# EAGLE design p2 020 (EAGLE 8.7.0)
COMPANY: ADAFRUIT INDUSTRIES; DRAWN: KTOWN; REV: B
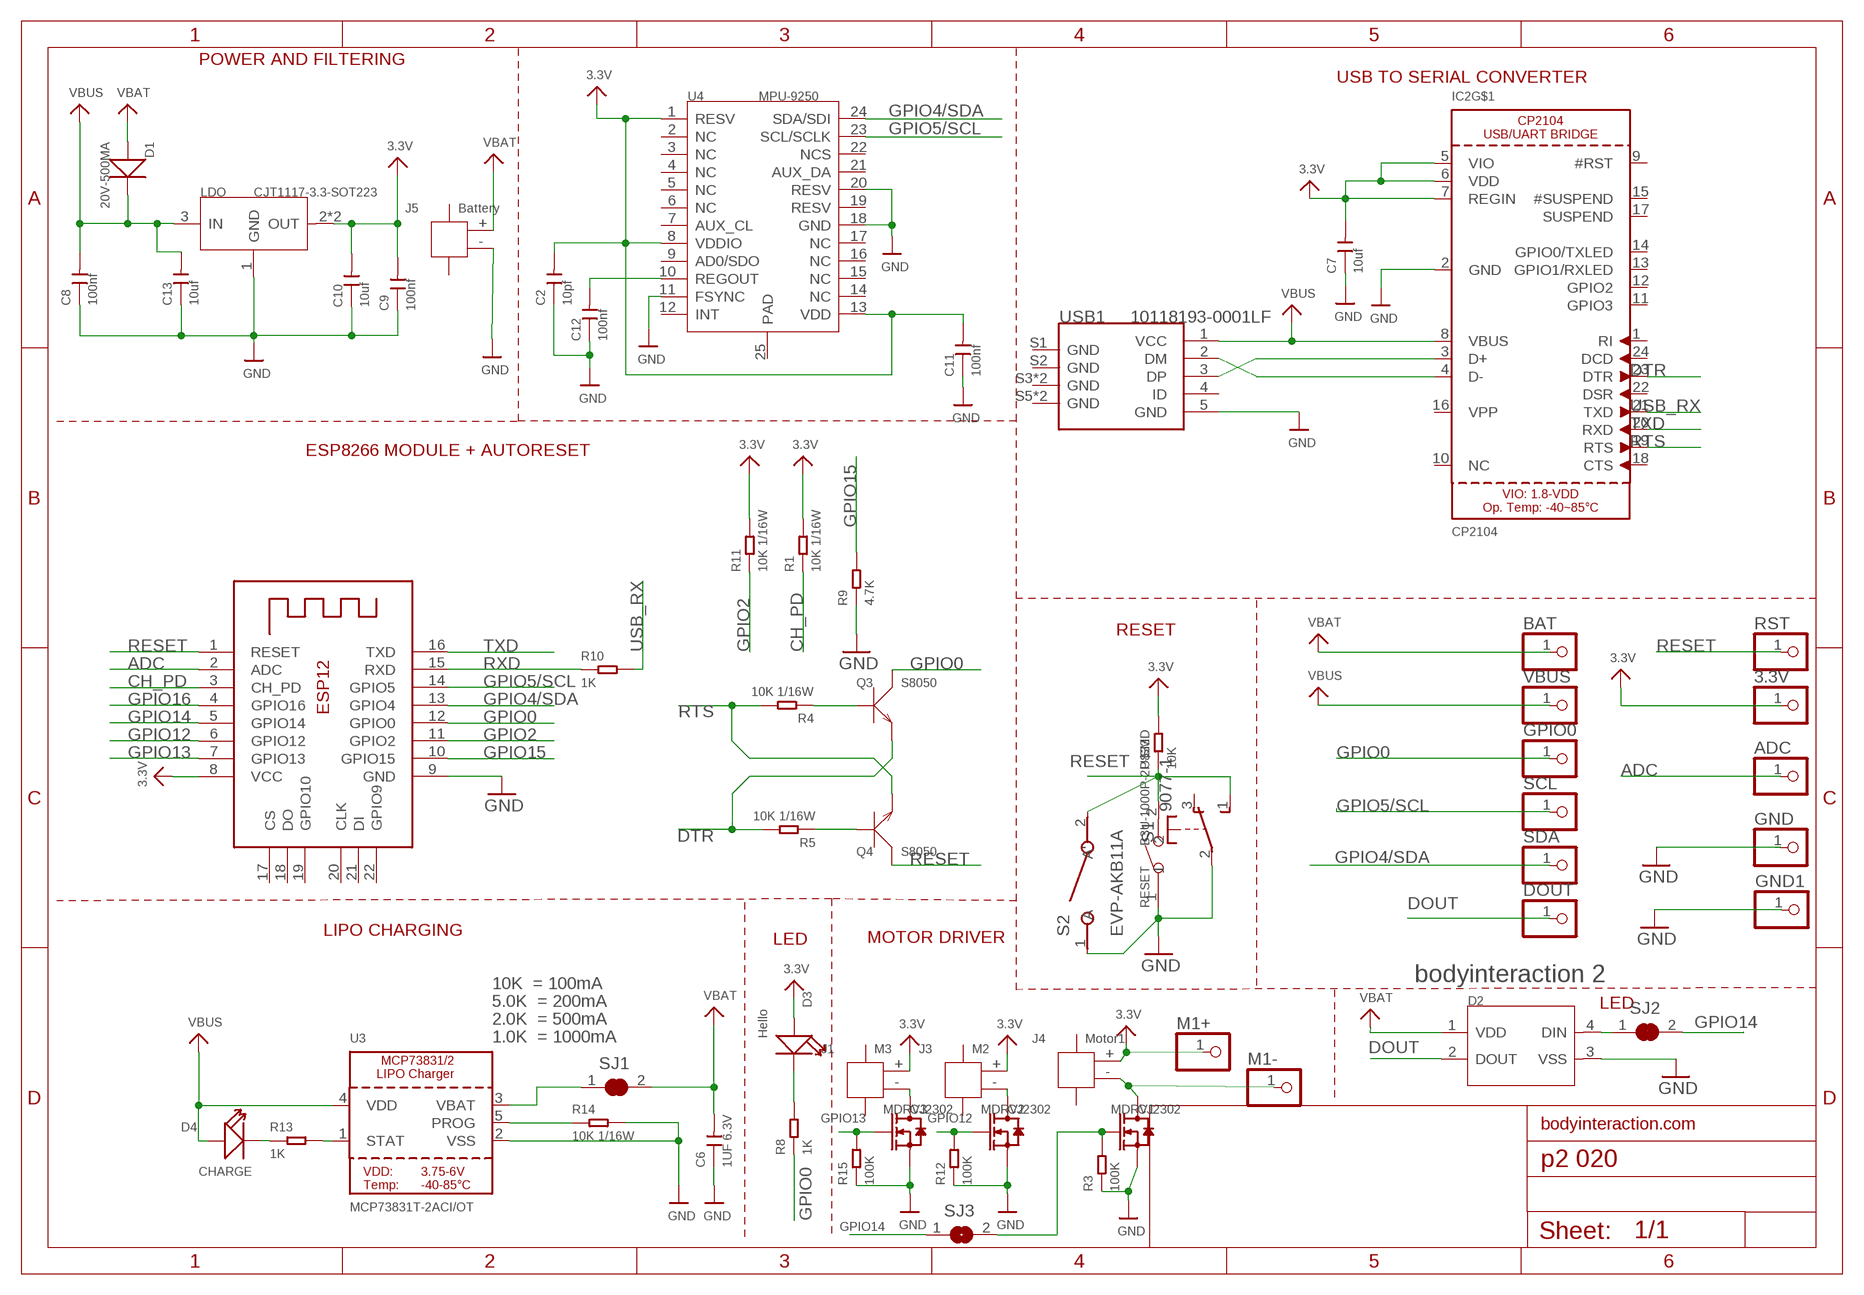
[diagram p0: schematic, sheet 1]

## Parts
3.3V  PINHD-1X1  [1X01]
ADC  PINHD-1X1  [1X01]
BAT  PINHD-1X1  [1X01]
C2  10pf  CERAMIC-10PF-50V-5%-NPO(0402)  [C0402]
C6  1UF 6.3V  CERAMIC-1UF-6.3V-10%-X5R(0402)  [C0402]
C7  10uf  CERAMIC-10UF-6.3V-20%-X5R(0402)  [C0402]
C8  100nf  CERAMIC-100NF-25V-10%-X7R(0402)  [C0402]
C9  100nf  CERAMIC-100NF-25V-10%-X7R(0402)  [C0402]
C10  10uf  CERAMIC-10UF-6.3V-20%-X5R(0402)  [C0402]
C11  100nf  CERAMIC-100NF-25V-10%-X7R(0402)  [C0402]
C12  100nf  CERAMIC-100NF-25V-10%-X7R(0402)  [C0402]
C13  10uf  CERAMIC-10UF-6.3V-20%-X5R(0402)  [C0402]
D1  20V-500MA  SMD-DIODE-SCHOTTKY-20V-500MA(SOD-123)P  [SOD-123]
D2  SMD-RGB-LED-4P'WS2812B'  [LED4-SMD-5050]
D3  Hello  SMD-LED-CLEAR-YELLOW(0603)  [LED-0603]
D4  CHARGE  SMD-LED-YELLOW-DIFFUSED-PURE-WHITE(0402)  [LED-0402]
DOUT  PINHD-1X1  [1X01]
ESP  ESP-12  ESP-12E  [ESP-12E]
GND  PINHD-1X1  [1X01]
GND1  PINHD-1X1  [1X01]
GPIO0  PINHD-1X1  [1X01]
IC2  CP2104  [QFN24_4MM_SMSC]
J1  M3  SMD-JST-2P-1.0-90D  [HW2-SMD-1.0-90D]
J3  M2  SMD-JST-2P-1.0-90D  [HW2-SMD-1.0-90D]
J4  Motor1  SMD-JST-2P-1.0-90D  [HW2-SMD-1.0-90D]
J5  Battery  SMD-JST-2P-1.0-90D  [HW2-SMD-1.0-90D]
LDO  CJT1117-3.3-SOT223  PMIC-CJT1117-3.3(SOT223)  [SOT-223]
M1+  PINHD-1X1  [1X01]
M1-  PINHD-1X1  [1X01]
MDRV1  CJ2302  SMD-MOSFET-N-CH-20V-2.1A-CJ2302(SOT-23)  [SOT-23]
MDRV2  CJ2302  SMD-MOSFET-N-CH-20V-2.1A-CJ2302(SOT-23)  [SOT-23]
MDRV3  CJ2302  SMD-MOSFET-N-CH-20V-2.1A-CJ2302(SOT-23)  [SOT-23]
Q3  S8050  SMD-TRANSISTORS-NPN-25V-500MW-S8050(SOT-23)  [SOT-23]
Q4  S8050  SMD-TRANSISTORS-NPN-25V-500MW-S8050(SOT-23)  [SOT-23]
R1  10K 1/16W  SMD-RES-10K-1%-1/16W(0402)  [R0402]
R3  100K  SMD-RES-100K-1%-1/16W(0402)  [R0402]
R4  10K 1/16W  SMD-RES-10K-1%-1/16W(0402)  [R0402]
R5  10K 1/16W  SMD-RES-10K-1%-1/16W(0402)  [R0402]
R8  1K  SMD-RES-1K-5%-1/16W(0402)  [R0402]
R9  4.7K  SMD-RES-4.7K-5%-1/16W(0402)  [R0402]
R10  1K  SMD-RES-1K-5%-1/16W(0402)  [R0402]
R11  10K 1/16W  SMD-RES-10K-1%-1/16W(0402)  [R0402]
R12  100K  SMD-RES-100K-1%-1/16W(0402)  [R0402]
R13  1K  SMD-RES-1K-5%-1/16W(0402)  [R0402]
R14  10K 1/16W  SMD-RES-10K-1%-1/16W(0402)  [R0402]
R15  100K  SMD-RES-100K-1%-1/16W(0402)  [R0402]
RESET  B3U-1000P-2P-SMD  SMD-BUTTON(2P-3.0X2.5X1.2+0.4MM)-B3U-1000P-2P-SMD  [SW2-2.6-3.0X2.5X1.2+0.4MM]
RST  PINHD-1X1  [1X01]
S1  9077-1  [9077-1]
S2  EVP-AKB11A  [SW_EVP-AKB11A]
SCL  PINHD-1X1  [1X01]
SDA  PINHD-1X1  [1X01]
SJ1  SOLDERJUMPER_CLOSED  [SOLDERJUMPER_CLOSEDWIRE]
SJ2  SOLDERJUMPER_CLOSED  [SOLDERJUMPER_CLOSEDWIRE]
SJ3  SJ  [SJ]
U3  MCP73831T-2ACI/OT  MCP73831/2  [SOT23-5]
U4  MPU-9250  MOTION/POSITION-MPU-9250(QFN24)  [QFN24G-0.4-3X3MM]
U$33  10K  SMD-RES-10K-5%-1/(0402)  [R0402]
USB1  10118193-0001LF  MICRO-USB-SMD-B-(10118193-0001LF)  [MICRO-USB5+6P-SMD-0.65-B]
VBUS  PINHD-1X1  [1X01]

## Nets
3.3V: 3.3V.1 C2.2 C7.2 C9.2 C10.2 C11.2 D3.+ ESP.8(VCC) IC2.5(VIO) IC2.6(VDD) IC2.7(REGIN) J1.+ J3.+ J4.+ LDO.2(OUT) LDO.TER(OUT) M1+.1 R1.2 R11.2 U4.1(RESV) U4.8(VDDIO) U4.13(VDD) U$33.2
ADC: ADC.1 ESP.2(ADC)
CH_PD: ESP.3(CH_PD) R1.1
DOUT: D2.2(DOUT) DOUT.1
DTR: IC2.23(DTR) Q3.2(E) R5.2
GND [GROUND]: C2.1 C6.1 C7.1 C8.1 C9.1 C10.1 C11.1 C12.1 C13.1 D2.3(VSS) ESP.9(GND) GND1.1 GND.1 IC2.2(GND) J5.- LDO.1(GND) MDRV1.2(S) MDRV2.2(S) MDRV3.2(S) R3.1 R9.1 R12.1 R14.2 R15.1 RESET.1 S1.2(P) S2.1(A) U3.2(VSS) U4.11(FSYNC) U4.18(GND) U4.20(RESV) USB1.5(GND)
GPIO0: ESP.12(GPIO0) GPIO0.1 Q3.3(C) R8.1
GPIO2: ESP.11(GPIO2) R11.1
GPIO4/SDA [SDA]: ESP.13(GPIO4) SDA.1 U4.24(SDA/SDI)
GPIO5/SCL [SCL]: ESP.14(GPIO5) SCL.1 U4.23(SCL/SCLK)
GPIO12: ESP.6(GPIO12) MDRV2.1(G) R12.2
GPIO13: ESP.7(GPIO13) MDRV3.1(G) R15.2
GPIO14: ESP.5(GPIO14) SJ2.2 SJ3.1
GPIO15: ESP.10(GPIO15) R9.2
GPIO16: ESP.4(GPIO16)
N$1: J3.- MDRV2.3(D)
N$2: D4.- R13.1
N$3: J4.- M1-.1 MDRV1.3(D)
N$4: IC2.3(D+) USB1.3(DP)
N$5: D3.- R8.2
N$6: D2.4(DIN) SJ2.1
N$7: IC2.4(D-) USB1.2(DM)
N$8: MDRV1.1(G) R3.2 SJ3.2
N$9: C12.2 U4.10(REGOUT)
N$12: Q4.1(B) R5.1
N$13: Q3.1(B) R4.1
N$14: R13.2 U3.1(STAT)
N$15: R14.1 U3.5(PROG)
N$16: SJ1.1 U3.3(VBAT)
N$19: J1.- MDRV3.3(D)
RESET: ESP.1(RESET) Q4.3(C) RESET.2 RST.1 S1.1(S) S2.2(A') U$33.1
RTS: IC2.19(RTS) Q4.2(E) R4.2
RXD: ESP.15(RXD) R10.1
TXD: ESP.16(TXD) IC2.20(RXD)
USB_RX: IC2.21(TXD) R10.2
VBAT [POWER]: BAT.1 C6.2 D1.+ D2.1(VDD) J5.+ SJ1.2
VBUS [POWER]: C8.2 C13.2 D1.- D4.+ IC2.8(VBUS) LDO.3(IN) U3.4(VDD) USB1.1(VCC) VBUS.1
Unconnected: ESP.17(CS) ESP.18(DO) ESP.19(GPIO10) ESP.20(CLK) ESP.21(DI) ESP.22(GPIO9) IC2.1(RI) IC2.9(#RST) IC2.10(NC) IC2.11(GPIO3) IC2.12(GPIO2) IC2.13(GPIO1/RXLED) IC2.14(GPIO0/TXLED) IC2.15(#SUSPEND) IC2.16(VPP) IC2.17(SUSPEND) IC2.18(CTS) IC2.22(DSR) IC2.24(DCD) J1.3 J1.4 J3.3 J3.4 J4.3 J4.4 J5.3 J5.4 S1.3(O) U4.2(NC) U4.3(NC) U4.4(NC) U4.5(NC) U4.6(NC) U4.7(AUX_CL) U4.9(AD0/SDO) U4.12(INT) U4.14(NC) U4.15(NC) U4.16(NC) U4.17(NC) U4.19(RESV) U4.21(AUX_DA) U4.22(NCS) U4.25(PAD) USB1.4(ID) USB1.S1(GND) USB1.S2(GND) USB1.S3(GND) USB1.S4(GND) USB1.S5(GND) USB1.S6(GND)

## Notes on the sheet
- POWER AND FILTERING
- USB TO SERIAL CONVERTER
- ESP8266 MODULE + AUTORESET
- RESET
- LIPO CHARGING
- LED | MOTOR DRIVER
- bodyinteraction 2
- 10K  = 100mA
- 5.0K  = 200mA | LED
- 2.0K  = 500mA
- 1.0K  = 1000mA
- bodyinteraction.com

## Power pins joined to a net without a drawn wire
TP: IC2.THERM(TP)

## Library data of the parts
3.3V ADC BAT DOUT GND GND1 GPIO0 M1+ M1- RST SCL SDA VBUS = pinhead:PINHD-1X1: PIN HEADER
C2 = Seeed-Capacitor-2016:CERAMIC-10PF-50V-5%-NPO(0402): 302010001; MPN: CC0402JRNPO9BN100
C6 = Seeed-OPL-Capacitor:CERAMIC-1UF-6.3V-10%-X5R(0402): 302010003; MPN: CC0402KRX5R5BB105
C7 C10 C13 = Seeed-OPL-Capacitor:CERAMIC-10UF-6.3V-20%-X5R(0402): 302010053; MPN: CC0402MRX5R5BB106
C8 C9 = Seeed-OPL-Capacitor:CERAMIC-100NF-25V-10%-X7R(0402): 302010024; MPN: CC0402KRX7R8BB104
C11 C12 = Seeed-Capacitor-2016:CERAMIC-100NF-25V-10%-X7R(0402): 302010024; MPN: CC0402KRX7R8BB104
D1 = Seeed-Diode-2016:SMD-DIODE-SCHOTTKY-20V-500MA(SOD-123)P: 304020028; MPN: MBR0520LT1G
D2 = Seeed-OPL-2017-01-Diode-james:SMD-RGB-LED-4P: 304990003
D3 = Seeed-OPL-Diode:SMD-LED-CLEAR-YELLOW(0603): 304090044; MPN: 19-217-Y5C-AM1N1VY-3T; VALUE: YELLOW-0603
D4 = Seeed-OPL-Diode:SMD-LED-YELLOW-DIFFUSED-PURE-WHITE(0402): 304090016; MPN: 16-219A/T2D-AR2T1QY/3T; VALUE: PURE-WHITE-0402
ESP = microbuilder:ESP-12E
IC2 = microbuilder:CP2104: CP2104 - USB to UART Bridge VDD Output: 3.45V
J1 J3-J5 = Seeed-Connector -2016:SMD-JST-2P-1.0-90D: 320110054; VALUE: 2p-smd-1.0-90d
LDO = Seeed-IC-2016:PMIC-CJT1117-3.3(SOT223): 310030097; MPN: CJT1117-3.3
MDRV1-MDRV3 = Seeed-Transistor-2016:SMD-MOSFET-N-CH-20V-2.1A-CJ2302(SOT-23): 305030015; MPN: CJ2302
Q3 Q4 = Seeed-Transistor-2016:SMD-TRANSISTORS-NPN-25V-500MW-S8050(SOT-23): 305010017; MPN: S8050
R1 R4 R5 R11 = Seeed-Resistor-2016:SMD-RES-10K-1%-1/16W(0402): 301010047; MPN: RC0402FR-0710KL
R3 R12 R15 = Seeed-OPL-Resistor:SMD-RES-100K-1%-1/16W(0402): 301010456; MPN: RC0402FR-07100KL
R8 R10 = Seeed-Resistor-2016:SMD-RES-1K-5%-1/16W(0402): 301010006; MPN: RC0402JR-071KL
R9 = Seeed-Resistor-2016:SMD-RES-4.7K-5%-1/16W(0402): 301010010; MPN: RC0402JR-074K7L
R13 = Seeed-OPL-Resistor:SMD-RES-1K-5%-1/16W(0402): 301010006; MPN: RC0402JR-071KL
R14 = Seeed-OPL-Resistor:SMD-RES-10K-1%-1/16W(0402): 301010047; MPN: RC0402FR-0710KL
RESET = Seeed-Switch-2016:SMD-BUTTON(2P-3.0X2.5X1.2+0.4MM): 311020047; MPN: B3U-1000P-2P-SMD
S1 = switch-misc:9077-1: MARQUARDT SWITCH 9077.0100 Distributor: Buerklin <https://www.buerklin.com/default.asp?event=ShowArtikel%2812G2820%29&l=d&jump=ArtNr_12G2820>
S2 = EVP-AKB11A:EVP-AKB11A: Switch Tactile N.O. SPST Rectangular Button Gull Wing 0.02A 15VDC 200000Cycles 1.6N SMD Embossed T/R; DESCRIPTION: Switch Tactile N.O. SPST Rectangular Button Gull Wing 0.02A 15VDC 200000Cycles 1.6N SMD Embossed T/R; DIGI-KEY_PART_NUMBER: P17065CT-ND; DIGI-KEY_PURCHASE_URL: https://www.digikey.de/product-detail/en/panasonic-electronic-components/EVP-AKB11A/P17065CT-ND/5131594?WT.z_cid=ref_snapeda&utm_source=snapeda&utm_medium=aggregator&utm_campaign=buynow; MF: Panasonic; MP: EVP-AKB11A; PACKAGE: None
SJ1 SJ2 = microbuilder:SOLDERJUMPER_CLOSED: Solder Jumper - Closed These solder jumpers are closed by default CLOSEDWIRE - 10 mil trace between pads that can be cut and resoldered later CLOSEDPERM - 63 mil trace between pads for a permanent connection (used to 'bridge' two signals, a shameless hack for Eagle). Can double as a test point as well (no cream layer)
SJ3 = jumper:SJ: SMD solder JUMPER
U3 = microbuilder:MCP73831/2: MCP73831/2 LIPO Charger VDD: 3.75 - 6V Temp -40 - 85°C Programmable Charge Rate: 15-500mA NOTE: STAT is a tri-state logic output on the MCP73831 and an open-drain output on the MCP73832. SOT23-5 with 4.2V output and tri-state logic on STAT = MCP73831T-2ACI/OT
U4 = Seeed-Sensor-2016:MOTION/POSITION-MPU-9250(QFN24): 314990005; MPN: MPU-9250
U$33 = Seeed-Resistor-2016:SMD-RES-10K-5%-1/(0402): 301010004; MPN: RC0402JR-0710KL
USB1 = Seeed-Connector -2016:MICRO-USB-SMD-B-(10118193-0001LF): 320010003; MPN: 10118193-0001LF

## Net classes
0 default: width 0.203 mm
1 SDA: width 0.203 mm
2 SCL: width 0.203 mm
3 POWER: width 0.305 mm
4 GROUND: width 0.305 mm

## Board
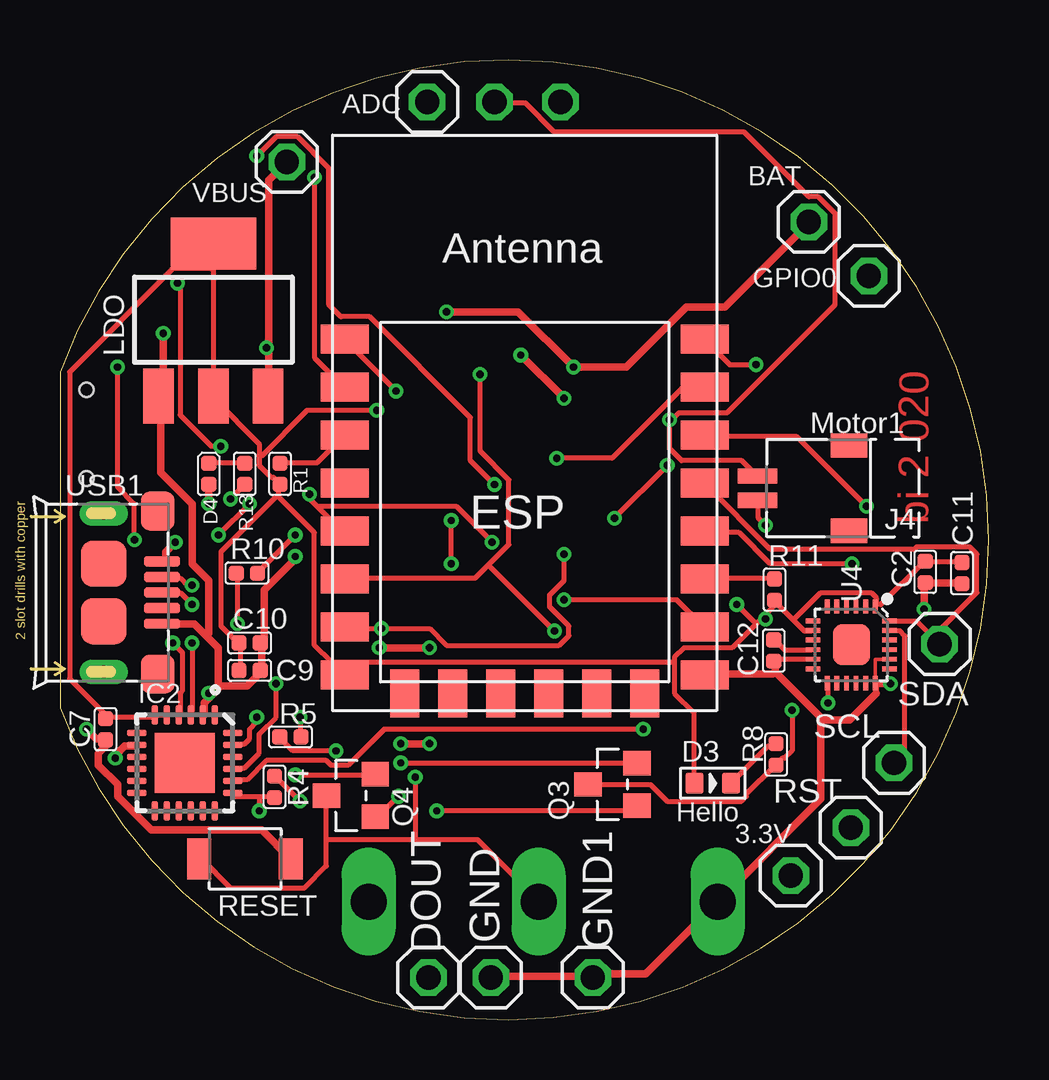
[diagram p1: board, top side]
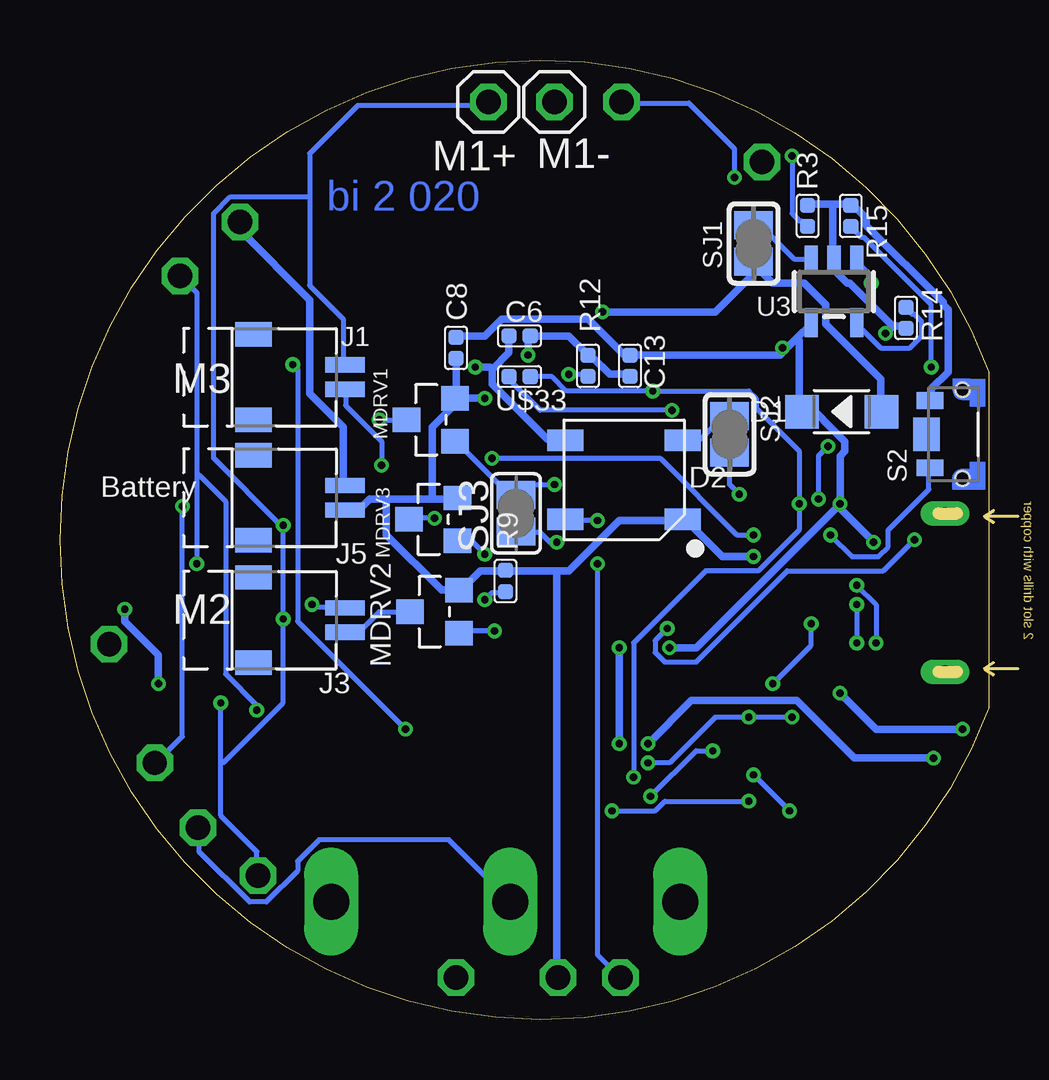
[diagram p2: board, bottom side, seen from below]

Size 38.7 x 40 mm. Coordinates in mm from the lower left corner, seen from the top.
Outline: 38.7,20 arc-90 18.7,0 arc-70 0,13 0,27 arc-70 18.7,40
Outline: 38.7,20 arc90 18.7,40
Outline: 38.7,20 arc90 18.7,40
Copper layers (1*16): Top 0.035mm / dielectric 1.5mm / Bottom 0.035mm
Design rules "SeeedStudio_2layer_DRU_no_angle_20140221": minimum track width 6mil, minimum drill 12mil, track to track 6mil, track to pad 6mil, pad to pad 6mil, via to via 6mil, smd to smd 0mil, copper to edge 10mil, drill to drill 10mil, minimum pad ring 10mil, minimum via ring 6mil, stop-mask expansion 2mil, vias tented up to drill 100mil, thermal gap 10mil

### Footprints (pad centres in the part's own frame; a part is rotated, then mirrored left to right if it is on the bottom)
1X01 = drill 1.016 octagon: 1 0,0
C0402 = smd 0.635 x 0.635: 1 0,0.445; 2 0,-0.445
SOD-123 = smd 1.397 x 1.397: + -1.651,0; - 1.651,0
LED4-SMD-5050 = smd 1.5 x 0.9: 1 -2.45,1.65; 2 -2.45,-1.65; 3 2.45,-1.65; 4 2.45,1.65
LED-0603 = smd 0.762 x 0.889: + -0.762,0; - 0.762,0
LED-0402 = smd 0.635 x 0.635: + -0.445,0; - 0.445,0
ESP-12E = smd 2 x 1.2: 1 -7.5,5.77; 2 -7.5,3.77; 3 -7.5,1.77; 4 -7.5,-0.23; 5 -7.5,-2.23; 6 -7.5,-4.23; 7 -7.5,-6.23; 8 -7.5,-8.23; 9 7.5,-8.23; 10 7.5,-6.23; 11 7.5,-4.23; 12 7.5,-2.23; 13 7.5,-0.23; 14 7.5,1.77; 15 7.5,3.77; 16 7.5,5.77 | smd 1.2 x 2: 17 -5,-9; 18 -3,-9; 19 -1,-9; 20 1,-9; 21 3,-9; 22 5,-9
QFN24_4MM_SMSC = smd 0.8 x 0.28: 1 -2,1.25; 2 -2,0.75; 3 -2,0.25; 4 -2,-0.25; 5 -2,-0.75; 6 -2,-1.25; 13 2,-1.25; 14 2,-0.75; 15 2,-0.25; 16 2,0.25; 17 2,0.75; 18 2,1.25 | smd 0.28 x 0.8: 7 -1.25,-2; 8 -0.75,-2; 9 -0.25,-2; 10 0.25,-2; 11 0.75,-2; 12 1.25,-2; 19 1.25,2; 20 0.75,2; 21 0.25,2; 22 -0.25,2; 23 -0.75,2; 24 -1.25,2 | smd 2.5 x 2.5: THERM 0,0
HW2-SMD-1.0-90D = smd 1.524 x 1.016: 3 -3.429,1.778; 4 -3.429,-1.778 | smd 1.651 x 0.635: + 0.381,0.508; - 0.381,-0.508
SOT-223 = smd 1.27 x 2.286: 1 -2.286,-3.175; 2 0,-3.175; 3 2.286,-3.175 | smd 3.556 x 2.159: TER 0,3.175
SOT-23 = smd 1.016 x 1.143: 1 -0.889,-1.016; 2 0.889,-1.016; 3 0,1.016
R0402 = smd 0.635 x 0.635: 1 0,0.445; 2 0,-0.445
SW2-2.6-3.0X2.5X1.2+0.4MM = smd 1 x 1.7: 1 -1.9,0; 2 1.9,0
9077-1 = drill 1.5 long: 1 7.96,7.984; 2 0.5,7.984; 3 15.04,7.984
SW_EVP-AKB11A = smd 1.1 x 0.7: 1 -1.35,1.4; 2 -1.35,-1.4 | smd 1.1 x 1.4: P1 -1.5,0 | hole 0.6: 0,1.85; 0,-1.85
SOLDERJUMPER_CLOSEDWIRE = smd 1.168 x 1.6: 1 -0.762,0; 2 0.762,0 | smd 0.635 x 0.203: WIRE 0,0
SJ = smd 1.168 x 1.6: 1 -0.762,0; 2 0.762,0
SOT23-5 = smd 0.55 x 1.2: 1 -0.95,-1.3; 2 0,-1.3; 3 0.95,-1.3; 4 0.95,1.3; 5 -0.95,1.3
QFN24G-0.4-3X3MM = smd 0.6 x 0.2: 1 -1.6,1; 2 -1.6,0.6; 3 -1.6,0.2; 4 -1.6,-0.2; 5 -1.6,-0.6; 6 -1.6,-1; 13 1.6,-1; 14 1.6,-0.6; 15 1.6,-0.2; 16 1.6,0.2; 17 1.6,0.6; 18 1.6,1 | smd 0.2 x 0.6: 7 -1,-1.6; 8 -0.6,-1.6; 9 -0.2,-1.6; 10 0.2,-1.6; 11 0.6,-1.6; 12 1,-1.6; 19 1,1.6; 20 0.6,1.6; 21 0.2,1.6; 22 -0.2,1.6; 23 -0.6,1.6; 24 -1,1.6 | smd 1.7 x 1.54: 25 0,0
MICRO-USB5+6P-SMD-0.65-B = smd 0.4 x 1.5: 1 -1.3,-0.25; 2 -0.65,-0.25; 3 0,-0.25; 4 0.65,-0.25; 5 1.3,-0.25 | smd 1.6 x 1.4: S1 -3.4,-0.427; S6 3.4,-0.427 | drill 0.508 pad 1.016 long: S2 -3.3,-2.675; S5 3.3,-2.675 | smd 1.9 x 1.9: S3 -1.2,-2.675; S4 1.2,-2.675

### Placement (x,y rotation side)
3.3V  30.45,6 0 top
ADC  15.3,38.25 0 top
BAT  31.2,33.25 0 top
C2  36.05,18.66 180 top
C6  19.55,28.5 270 bottom
C7  1.9,12.1 180 top
C8  22.2,28 180 bottom
C9  7.9,14.55 270 top
C10  7.9,15.7 270 top
C11  37.58,18.61 180 top
C12  29.74,15.38 180 top
C13  14.95,27.25 180 bottom
D1  6.13,25.34 180 bottom
D2  15.2,22.5 0 bottom
D3  27.2,9.85 0 top
D4  6.2,22.75 90 top
DOUT  15.35,1.75 0 top
ESP  19.36,22.6 0 top
GND  17.95,1.75 0 top
GND1  22.2,1.75 0 top
GPIO0  33.7,31 0 top
IC2  5.2,10.7 270 top
J1  27.2,26.78 0 bottom
J3  27.2,16.65 0 bottom
J4  29.45,22.15 180 top
J5  27.2,21.75 0 bottom
LDO  6.39,29.17 0 top
M1+  20.85,38.25 0 bottom
M1-  18.1,38.25 0 bottom
MDRV1  23.25,25 90 bottom
MDRV2  23.1,17 90 bottom
MDRV3  23.15,20.85 90 bottom
Q3  23.02,9.8 90 top
Q4  12.12,9.34 90 top
R1  9.17,22.75 0 top
R3  7.55,33.5 0 bottom
R4  8.94,9.7 0 top
R5  9.6,11.78 90 top
R8  29.84,11.05 180 top
R9  20.14,18.28 0 bottom
R10  7.79,18.61 270 top
R11  29.77,17.92 0 top
R12  16.7,27.25 0 bottom
R13  7.7,22.75 0 top
R14  3.45,29.25 0 bottom
R15  5.75,33.5 0 bottom
RESET  7.71,6.7 180 top
RST  32.95,8 0 top
S1  27.9,12.9 180 top
S2  1.1,24.4 0 bottom
SCL  34.75,10.7 0 top
SDA  36.65,15.65 0 top
SJ1  9.8,32.35 270 bottom
SJ2  10.8,24.4 270 bottom
SJ3  19.7,21.1 90 bottom
U3  6.45,30.35 180 bottom
U4  32.97,15.62 270 top
U$33  19.55,26.8 270 bottom
USB1  4.5,17.8 270 top
VBUS  9.45,35.75 0 top

### Tracks (layer width: path | path; a pad name or v marks a point on that pad's centre or on a via)
3.3V  (via drill 0.3)
  Top 0.203: v32,13.2 32,14 U4.13 | v29.4,20.6 29.1,20.9 29.1,21.6 J4.+ | C11.2 37.5,19.1 36.1,19.1 C2.2 36,19.1 34.2,17.3 34,17.3 U4.1 34,17.4 34,17.6 33.8,17.8 31.7,17.8 30.55,16.65 | 30.55,16.65 29.8,17.4 R11.2 29.8,17.3 29.25,16.75 | 30.55,16.65 31,16.2 31.3,16.2 U4.8 | 25.6,14.9 25.6,15.1 26,15.5 28,15.5 29,16.5 | 25.6,14.9 25.6,13.6 26.4,12.8 26.4,9.9 D3.+ | 29.25,16.75 29,16.5 | 29,16.5 v28.2,17.3 | IC2.5 IC2.6 4,12.6 3.2,12.6 | 8.3,23.5 8.3,24 6.4,25.9 LDO.2 6.4,32.3 LDO.TER 6.3,31.3 4.7,31.3 0.4,27 0.4,14.2 1.9,12.7 C7.2 1.9,12.6 3.2,12.6 | 8.3,23.5 8.3,23.1 8.8,22.6 8.9,22.6 9.1,22.4 R1.2 9.1,22.3 9.1,21.9 9.05,21.85 | v13.2,25.4 10.3,25.4 8.4,23.5 8.3,23.5 | 25.6,14.9 11.4,14.9 ESP.8 11.3,14.9 10.6,15.6 10.6,20.3 9.05,21.85 | v29.4,16.7 29.3,16.7 29.25,16.75 | 3.2,12.6 IC2.7 | C9.2 7.5,14.6 7.5,15.7 C10.2 7.4,15.7 6.7,16.4 6.7,19.5 9.05,21.85
  Bottom 0.203: 28.3,34.3 28.3,36.1 26.3,38.1 21,38.1 M1+.1 | 28.3,34.3 28.3,30.6 26.9,29.2 26.9,27.3 J1.+ | 32,10.7 32,8.5 30.5,7 30.5,6 3.3V.1 | 32,10.7 v32,13.2 | 32,10.7 31.9,10.7 29.4,13.2 v29.4,16.7 v29.4,20.6 29.5,20.6 32.3,23.4 32.3,33.6 31.6,34.3 28.3,34.3 | v28.2,17.3 28.1,17.2 26.9,17.2 J3.+ | v13.2,25.4 18.7,25.4 19.9,26.6 19.9,26.8 U$33.2
ADC  (via drill 0.3)
  Top 0.203: v10.6,35.1 10.6,27.6 11.8,26.4 ESP.2
  Bottom 0.203: v10.6,35.1 10.6,36.3 12.5,38.2 15.3,38.2 ADC.1
CH_PD
  Top 0.203: R1.1 9.2,23.2 10.7,23.2 11.8,24.3 ESP.3
DOUT  (via drill 0.3)
  Top 0.203: v16.3,19 v16.3,20.8
  Bottom 0.203: v16.3,20.8 17.6,20.8 D2.2 | v16.3,19 16.3,2.7 DOUT.1
DTR  (via drill 0.3)
  Top 0.203: v10,12.6 10,11.8 R5.2 | v8.2,12.6 8.2,12.4 7.9,12.1 7.9,11.7 7.7,11.5 7.2,11.5 IC2.23 | v14.2,10.7 24,10.7 Q3.2
  Bottom 0.203: v8.2,12.6 v10,12.6 11.4,12.6 13.3,10.7 v14.2,10.7
GND  (via drill 0.3)
  Top 0.152: 29.92,15.02 29.8,14.9 | U4.20 33.97,15.02 U4.18
  Top 0.2: U4.11 29.92,15.02
  Top 0.254: 34,13.6 34,14 | 34,14 U4.18 | 34,14 v34.6,14
  Top 0.305: C11.1 37.5,18.2 36.1,18.2 C2.1 36,18.1 v36,17.1 | 34,13.6 32.9,12.5 31.8,12.5 | 29.8,14.5 31.8,12.5 | 29.8,14.5 29.8,14.9 C12.1 | ESP.9 26.9,14.4 29.7,14.4 29.8,14.5 | GND.1 18,1.8 22.2,1.8 GND1.1 22.3,1.9 24.4,1.9 27.4,4.9 S1.2 27.5,5 31.7,9.2 31.7,12.4 31.8,12.5 | v4.3,28.6 4.3,26.2 4.2,26.1 LDO.1 4.2,25.9 4.2,22.8 5.5,21.5 5.5,19 6.2,18.3 6.2,16.1 6.1,16 | v21,25.9 v19.2,27.7 | RESET.1 8.4,7.9 3.8,7.9 2.4,9.3 2.4,9.8 1.6,10.6 1.6,11.1 1.9,11.4 C7.1 1.8,11.7 1.5,11.7 v1.1,12.1 | 6.7,13.9 6.3,13.5 | 6.3,13.5 6,13.2 6,12.7 IC2.2 | 6.7,13.9 7.8,13.9 8.3,14.4 C9.1 8.4,14.6 8.4,15.7 C10.1 8.5,15.8 8.5,17.9 9.8,19.2 v9.8,19.3 | USB1.5 5.6,16.5 6.1,16 | 6.1,16 6.6,15.5 6.6,14 6.7,13.9 | v6.2,13.6 6.3,13.5
  Bottom 0.305: v36,17.1 36,16.6 34.6,15.2 v34.6,14 | 6.5,34 7.5,34 R3.1 | 6.5,34 5.8,34 R15.1 5.6,33.9 5.1,33.4 5.1,33.1 1.9,29.9 1.9,29.8 1.7,29.6 1.7,27 2.4,26.3 2.4,25.8 S2.1 | 4,28.9 3.5,28.9 R14.2 | 4,28.9 5.8,30.7 5.9,30.7 6.4,31.2 6.4,31.6 U3.2 6.5,31.8 6.5,34 | v4.3,28.6 4,28.9 | C13.1 15,26.9 15.8,26.9 16.5,27.6 16.7,27.6 R12.1 16.8,27.8 17.5,28.5 C6.1 19.2,28.4 v19.2,27.7 | C8.1 22.2,25.9 MDRV1.2 | 25.1,21.7 25.8,21.7 26.2,21.3 26.8,21.3 J5.- | 25.1,21.7 23.2,21.7 | 23.2,21.7 22.2,21.7 MDRV3.2 | 23.2,21.7 23.2,24.7 22.3,25.6 22.3,25.8 MDRV1.2 | v21,25.9 22.1,25.9 MDRV1.2 | 18,18.7 20,18.7 R9.1 20.2,18.7 21.2,18.7 22,17.9 MDRV2.2 22.2,17.9 22.8,17.9 25.1,20.2 25.1,21.7 | 18,18.7 17.5,18.7 15.4,20.8 12.8,20.8 D2.3 12.6,20.8 11.1,19.3 v9.8,19.3 | 18,18.7 18,1.8 GND.1 | v1.1,12.1 4.7,12.1 v6.2,13.6
GPIO0  (via drill 0.3)
  Top 0.203: Q3.3 24.6,9.8 25.3,9.1 28.4,9.1 28.6,9.3 28.6,9.4 29.8,10.6 R8.1 29.9,10.7 30.1,10.9 30.2,10.9 30.5,11.2 v30.5,12.9 | v33,19 29.6,19 28.3,20.3 26.9,20.3 ESP.12
  Bottom 0.203: 33,22.7 33,30.3 GPIO0.1 | 33,22.7 v33,19 | v30.5,12.9 30.5,13.1 31.8,14.4 31.8,21.6 32.9,22.7 33,22.7
GPIO2
  Top 0.203: R11.1 29.7,18.4 26.9,18.4 ESP.11
GPIO4/SDA
  Top 0.203: U4.24 34.6,16.6 35.7,16.6 SDA.1 36.4,16 38.2,17.8 38.2,19.4 37.9,19.7 35.7,19.7 35.6,19.6 29.6,19.6 26.9,22.3 ESP.13
GPIO5/SCL  (via drill 0.3)
  Top 0.203: U4.23 34.6,16.2 35,16.2 35.2,16 35.2,11.1 34.8,10.7 SCL.1 | v33.6,21.4 30.7,24.3 26.9,24.3 ESP.14
  Bottom 0.203: v33.6,21.4 33.6,11.8 34.7,10.7 SCL.1
GPIO12  (via drill 0.3)
  Top 0.203: v17.5,26.9 17.5,23.7 18.7,22.5 18.7,19.8 17.85,18.95 | 17.85,18.95 17.3,18.4 11.9,18.4 ESP.6 | 17.85,18.95 v20.6,16.2
  Bottom 0.203: v17.5,26.9 16.7,26.9 R12.2 | v20.6,16.2 22,16.2 MDRV2.1
GPIO13  (via drill 0.3)
  Top 0.203: v2.4,27.2 2.4,22.2 3.1,21.5 v3.1,20 | ESP.7 11.9,16.3 v13.4,16.3 15.4,16.3 16.1,15.6 20.8,15.6 21.2,16 21.2,16.4 20.4,17.2 20.4,17.7 21,18.3 v21,19.4
  Bottom 0.203: v2.4,27.2 2.4,29.8 5.2,32.6 5.3,32.6 5.7,33 R15.2 | v3.1,20 4.4,18.7 8.4,18.7 12.2,14.9 13.5,14.9 13.9,15.3 13.9,15.8 v13.4,16.3 | v21,19.4 21.5,19.9 22.1,19.9 MDRV3.1
GPIO14  (via drill 0.3)
  Top 0.203: v10.4,21.9 10.4,21.7 10.75,21.35 | 10.75,21.35 11.8,20.3 ESP.5 | v18,19.9 16.5,21.4 10.8,21.4 10.75,21.35
  Bottom 0.203: SJ2.2 10.8,22.3 v10.4,21.9 | v18,19.9 18.3,19.9 18.7,20.3 19.7,20.3 SJ3.1
GPIO15  (via drill 0.3)
  Top 0.203: v21,17.5 25.7,17.5 26.8,16.4 ESP.10
  Bottom 0.203: v21,17.5 20.7,17.8 20.2,17.8 R9.2
N$1
  Bottom 0.203: MDRV2.3 25.4,17 26.2,16.2 26.8,16.2 J3.-
N$2
  Top 0.203: D4.- R13.1
N$3  (via drill 0.3)
  Top 0.203: J4.- 29,22.7 28.4,23.3 25.9,23.3 25.4,23.8 v25.4,25 25.5,25 25.8,25.3 27.8,25.3 32.3,29.8 32.3,33.6 31.6,34.3 31.2,34.3 28.5,37 20.6,37 19.4,38.2 18.1,38.2 M1-.1
  Bottom 0.203: v25.4,25 MDRV1.3
N$4  (via drill 0.3)
  Top 0.203: 5.5,12.7 IC2.3 | USB1.3 5,17.8 v5.5,17.3 | 5.5,12.8 IC2.3 | v5.5,15.7 5.5,12.9 IC2.3
  Bottom 0.203: v5.5,17.3 v5.5,15.7
N$5
  Top 0.203: R8.2 29.8,11.4 29.5,11.4 28,9.9 D3.-
N$6
  Bottom 0.203: D2.4 12.7,24.2 12,24.2 11.1,25.1 10.8,25.1 SJ2.1
N$7  (via drill 0.3)
  Top 0.203: v4.7,15.7 5.1,15.3 5.1,13.7 5,13.6 5,12.7 IC2.4 | v5.5,18.1 5.3,18.1 5,18.4 4.3,18.4 USB1.2
  Bottom 0.203: v4.7,15.7 4.7,17.3 v5.5,18.1
N$8  (via drill 0.3)
  Top 0.203: v8.2,36 9,36.8 9.9,36.8 11.2,35.5 11.2,29.8 11.7,29.3 12.9,29.3 17.1,25.1 17.1,23.3 v18.1,22.3
  Bottom 0.203: v8.2,36 8.2,33.6 7.9,33.3 7.8,33.3 7.6,33.1 R3.2 | v18.1,22.3 19.3,22.3 19.7,21.9 SJ3.2 19.8,21.9 20,21.9 22.2,24.1 MDRV1.1
N$9
  Top 0.203: U4.10 31.3,15.4 30.2,15.4 29.8,15.8 C12.2
N$12  (via drill 0.3)
  Top 0.203: v11.5,11.2 9.7,11.2 9.2,11.7 R5.1 | v14.1,9.3 13.2,8.4 Q4.1
  Bottom 0.203: v11.5,11.2 12.2,11.2 v14.1,9.3
N$13  (via drill 0.3)
  Top 0.203: v10,9.1 9,10.1 R4.1 | v15.7,8.7 23.8,8.7 24,8.9 Q3.1
  Bottom 0.203: v10,9.1 13.5,9.1 13.9,8.7 v15.7,8.7
N$14  (via drill 0.3)
  Top 0.203: v7.1,21.7 R13.2 | v6.7,23.9 6.3,23.9 5,25.2 5,30.6 v4.9,30.7
  Bottom 0.203: v7.1,21.7 7.1,23.5 v6.7,23.9 | v4.9,30.7 4.9,31 5.5,31.6 U3.1
N$15
  Bottom 0.203: R14.1 3.4,29.6 3.2,29.4 3.1,29.4 2.8,29.1 2.8,28.5 3.3,28 4.5,28 5.5,29 U3.5
N$16
  Bottom 0.203: U3.3 7.4,31.7 8.1,31.7 9.5,33.1 SJ1.1
N$19  (via drill 0.3)
  Top 0.203: v25.3,23.1 v23.1,20.9
  Bottom 0.203: v23.1,20.9 24.1,20.9 MDRV3.3 | v25.3,23.1 25.3,24.1 26.8,25.6 26.8,26.2 J1.-
RESET  (via drill 0.3)
  Top 0.203: 11.1,7.5 11.1,6.4 10.2,5.5 7.1,5.5 5.9,6.7 RESET.2 | 11.1,7.5 11.1,9.3 Q4.3 | 14.8,7.5 17.4,7.5 19.9,5 S1.1 | 14.8,7.5 11.1,7.5 | v14,26.2 11.9,28.3 ESP.1 | v7.9,21.5 v6.6,20.2 | v14.8,10.1 14.8,7.5
  Bottom 0.203: RST.1 32.9,8 32.9,7 30.8,4.9 30.1,4.9 28.8,6.2 28.8,6.6 27.9,7.5 22.5,7.5 20,5 S1.1 | U$33.1 18.2,26.8 17.6,26.2 v14,26.2 10,26.2 9.7,25.9 9.7,25.5 7.9,23.7 v7.9,21.5 7.9,20.4 9.6,18.7 11.8,18.7 14.8,15.7 v14.8,10.1 | v6.6,20.2 5.7,19.3 4.6,19.3 4.2,19.7 4.2,20.4 2.5,22.1 2.5,23 S2.2
RTS  (via drill 0.3)
  Top 0.203: 8.3,9.3 7.3,9.3 7.2,9.4 IC2.19 | 8.3,9.3 8.9,9.3 R4.2 | v9.8,10.2 13.1,10.2 Q4.2 | 8.3,9.3 v8.3,8.7
  Bottom 0.203: v8.3,8.7 v9.8,10.2
RXD  (via drill 0.3)
  Top 0.203: v9.8,20.2 8.3,18.7 R10.1 | v20.7,23.4 23,23.4 25.9,26.3 26.8,26.3 ESP.15
  Bottom 0.203: v9.8,20.2 10.5,20.2 13.7,23.4 v20.7,23.4
TXD  (via drill 0.3)
  Top 0.203: v24.3,12.1 13.5,12.1 12,10.6 11.3,10.6 11.1,10.8 8.6,10.8 7.8,10 7.2,10 IC2.20 | v29,27.3 27.9,27.3 26.9,28.3 ESP.16
  Bottom 0.203: v24.3,12.1 28.8,16.6 28.8,27.1 v29,27.3
USB_RX  (via drill 0.3)
  Top 0.203: R10.2 7.4,18.6 v7.4,16.5 | v9,14 9,12.6 8.3,11.9 8.3,11.1 7.7,10.5 7.2,10.5 IC2.21
  Bottom 0.203: v7.4,16.5 7.4,15.6 v9,14
VBAT  (via drill 0.3)
  Top 0.305: BAT.1 31.2,33.2 27.7,29.7 26.1,29.7 23.6,27.2 v21.4,27.2 19.1,29.5 v16.1,29.5
  Bottom 0.305: D1.+ 4.5,25.4 4.5,26.7 6.8,29 6.8,29.8 7.7,30.7 9,30.7 9.8,31.5 SJ1.2 9.7,31.2 11.4,29.5 v16.1,29.5 | 20.7,27.1 20,27.8 C6.2 | 20.7,27.1 20.7,26.5 18.4,24.2 17.7,24.2 D2.1 | BAT.1 31.2,32.9 28.3,30 28.3,26.1 26.9,24.7 26.9,22.3 J5.+ | v21.4,27.2 20.8,27.2 20.7,27.1
VBUS  (via drill 0.3)
  Top 0.305: 8.7,28 8.7,35 VBUS.1 | 8.7,28 8.7,26 LDO.3 | v8.6,28 8.7,28 | v6.2,21.5 D4.+ | v2.3,10.9 2.3,11 2.7,11.4 3.2,11.4 IC2.8 | v15.4,11.5 v14.2,11.5 | v13.3,15.5 v15.4,15.5 | 4.3,19.1 USB1.1 4.4,19.2 4.4,19.5 v4.8,19.9
  Bottom 0.305: 8,28.4 7.4,29 U3.4 | 8,28.4 8.5,27.9 | 8.5,27.9 8.7,27.7 14.9,27.7 C13.2 15.1,27.7 15.2,27.7 16.7,29.2 20.3,29.2 21,28.5 22.2,28.5 C8.2 | v8.6,28 8.5,27.9 | 8,28.4 7.9,28.3 7.9,25.4 D1.- 7.8,25.9 6,24.1 6,23.7 6.2,23.5 v6.2,21.5 | v2.3,10.9 5.6,10.9 8,13.3 12.4,13.3 v14.2,11.5 | v15.4,15.5 v15.4,11.5 | v13.3,15.5 12.2,15.5 v6.2,21.5 | v4.8,19.9 6.2,21.3 v6.2,21.5

### Text on the board
Top: bi 2 020
Bottom: bi 2 020